# Altium schematic sheet 08-USB&TF.SchDoc
size A4
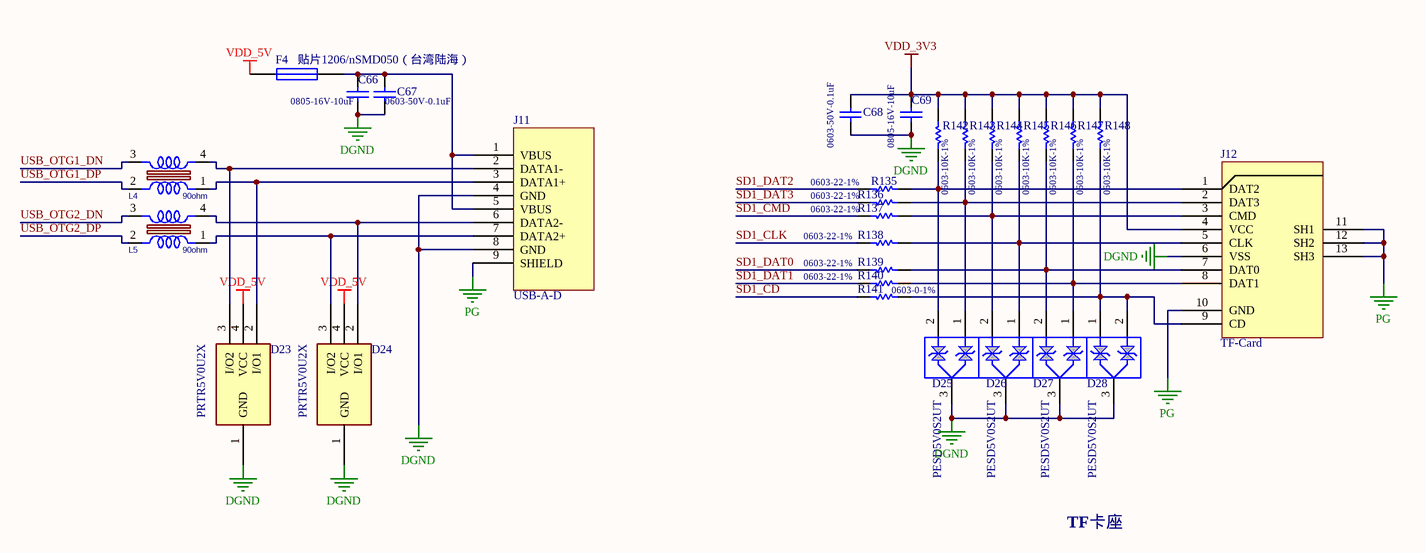
[diagram p0: 08-USB&TF.SchDoc]

## Parts
C66  0805-16V-10uF  [0805C]
C67  0603-50V-0.1uF  [0603C]
C68  0603-50V-0.1uF  [0603C]
C69  0805-16V-10uF  [0805C]
D23  PRTR5V0U2X  [SOT-143]
D24  PRTR5V0U2X  [SOT-143]
D25  PESD5V0S2UT  [SOT-23]
D26  PESD5V0S2UT  [SOT-23]
D27  PESD5V0S2UT  [SOT-23]
D28  PESD5V0S2UT  [SOT-23]
F4  贴片1206/nSMD050（台湾陆海）  [1206F]
J11  USB-A-D  [USB-AF-D]
J12  TF-Card  [SDCARD-M]
L4  90ohm  [indcm-sdcw2012]
L5  90ohm  [indcm-sdcw2012]
R135  0603-22-1%  [0603R]
R136  0603-22-1%  [0603R]
R137  0603-22-1%  [0603R]
R138  0603-22-1%  [0603R]
R139  0603-22-1%  [0603R]
R140  0603-22-1%  [0603R]
R141  0603-0-1%  [0603R]
R142  0603-10K-1%  [0603R]
R143  0603-10K-1%  [0603R]
R144  0603-10K-1%  [0603R]
R145  0603-10K-1%  [0603R]
R146  0603-10K-1%  [0603R]
R147  0603-10K-1%  [0603R]
R148  0603-10K-1%  [0603R]

## Nets
DGND: C66.2 C67.2 C68.2 C69.2 D23.1(GND) D24.1(GND) D25.3 D26.3 D27.3 D28.3 J11.4(GND) J11.8(GND) J12.6(VSS)
PG: J11.9(SHIELD) J12.10(GND) J12.11(SH1) J12.12(SH2) J12.13(SH3)
VDD_3V3: C68.1 C69.1 J12.4(VCC) R142.1 R143.1 R144.1 R145.1 R146.1 R147.1 R148.1
VDD_5V: D23.4(VCC) D24.4(VCC) F4.1
SD1_CD: R141.2
SD1_CLK: R138.2
SD1_CMD: R137.2
SD1_DAT0: R139.2
SD1_DAT1: R140.2
SD1_DAT2: R135.2
SD1_DAT3: R136.2
USB_OTG1_DN: L4.3
USB_OTG1_DP: L4.2
USB_OTG2_DN: L5.3
USB_OTG2_DP: L5.2
NetC66_1: C66.1 C67.1 F4.2 J11.1(VBUS) J11.5(VBUS)
NetD23_2: D23.2(I/O1) J11.3(DATA1+) L4.1
NetD23_3: D23.3(I/O2) J11.2(DATA1-) L4.4
NetD24_2: D24.2(I/O1) J11.6(DATA2-) L5.4
NetD24_3: D24.3(I/O2) J11.7(DATA2+) L5.1
NetD25_1: D25.1 J12.2(DAT3) R136.1 R143.2
NetD25_2: D25.2 J12.1(DAT2) R135.1 R142.2
NetD26_1: D26.1 J12.5(CLK) R138.1 R145.2
NetD26_2: D26.2 J12.3(CMD) R137.1 R144.2
NetD27_1: D27.1 J12.8(DAT1) R140.1 R147.2
NetD27_2: D27.2 J12.7(DAT0) R139.1 R146.2
NetD28_1: D28.1 D28.2 J12.9(CD) R141.1 R148.2

## Notes on the sheet
- TF卡座

## Library data of the parts
C66-C69 = Cap: Capacitor; Value: 10nF; Published: 8-Jun-2000; Revision: July-2002: Re-released for DXP Platform.; Publisher: Altium Limited
D23 D24 = 1.05.10.0153: PRTR5V0U2X,SOT-143B,NXP,RoHS; 名称: IC; 设备封装名称: SOT-143B_PRTR5V0U2X; 贴片和直插: SMT; 物料代码: 1.05.10.0153; Value: PRTR5V0U2X; 封装: SOT-143B; 厂商: NXP; RoHS: RoHS; 型号: PRTR5V0U2X; ComponentLink1Description: ErpDataInfo; ComponentLink1URL: http://erp.zlgmcu.com/ErpExt/ErpData/ListMateriel.aspx?pkey=1.05.10.0153
D25-D27 = NUP2105L: TVS protect; Value: DNF
D28 = NUP2105L: TVS protect; Value: TVS
F4 = Fuse 1: Fuse; Published: 8-Jun-2000; LatestRevisionDate: 17-Jul-2002; LatestRevisionNote: Re-released for DXP Platform.; PackageReference: PIN-W2/E2.8; Publisher: Altium Limited; PackageDescription: Thru-Hole; 2 Leads
J12 = TF01A: Name: TF卡座; 封装: TF-CARD
L4 L5 = Common Choke: 共模电感; name: WCM2012F2SF-900T04; name th: SDCW2012-2-121TF; Reserve Value: 120ohm; Part Type: Common Inductor
R135-R140 = Res1: Resistor; Value: 22; Published: 8-Jun-2000; LatestRevisionDate: 17-Jul-2002; LatestRevisionNote: Re-released for DXP Platform.; PackageReference: AXIAL-0.3; Publisher: Altium Limited
R141 = Res1: Resistor; Value: 0R; Published: 8-Jun-2000; LatestRevisionDate: 17-Jul-2002; LatestRevisionNote: Re-released for DXP Platform.; PackageReference: AXIAL-0.3; Publisher: Altium Limited
R142-R148 = Res1: Resistor; Value: 10K; Published: 8-Jun-2000; LatestRevisionDate: 17-Jul-2002; LatestRevisionNote: Re-released for DXP Platform.; PackageReference: AXIAL-0.3; Publisher: Altium Limited